# EasyEDA Pro project 分电板.eprj

# Schematic Schematic1
Board Name: Board1; Create Date: 2025-06-07; Page Name: P1; Project Name: 分电板; Schematic Name: Schematic1; Update Date: 2025-06-15; Company: 嘉立创EDA; Page Size: A4; Version: V1.0
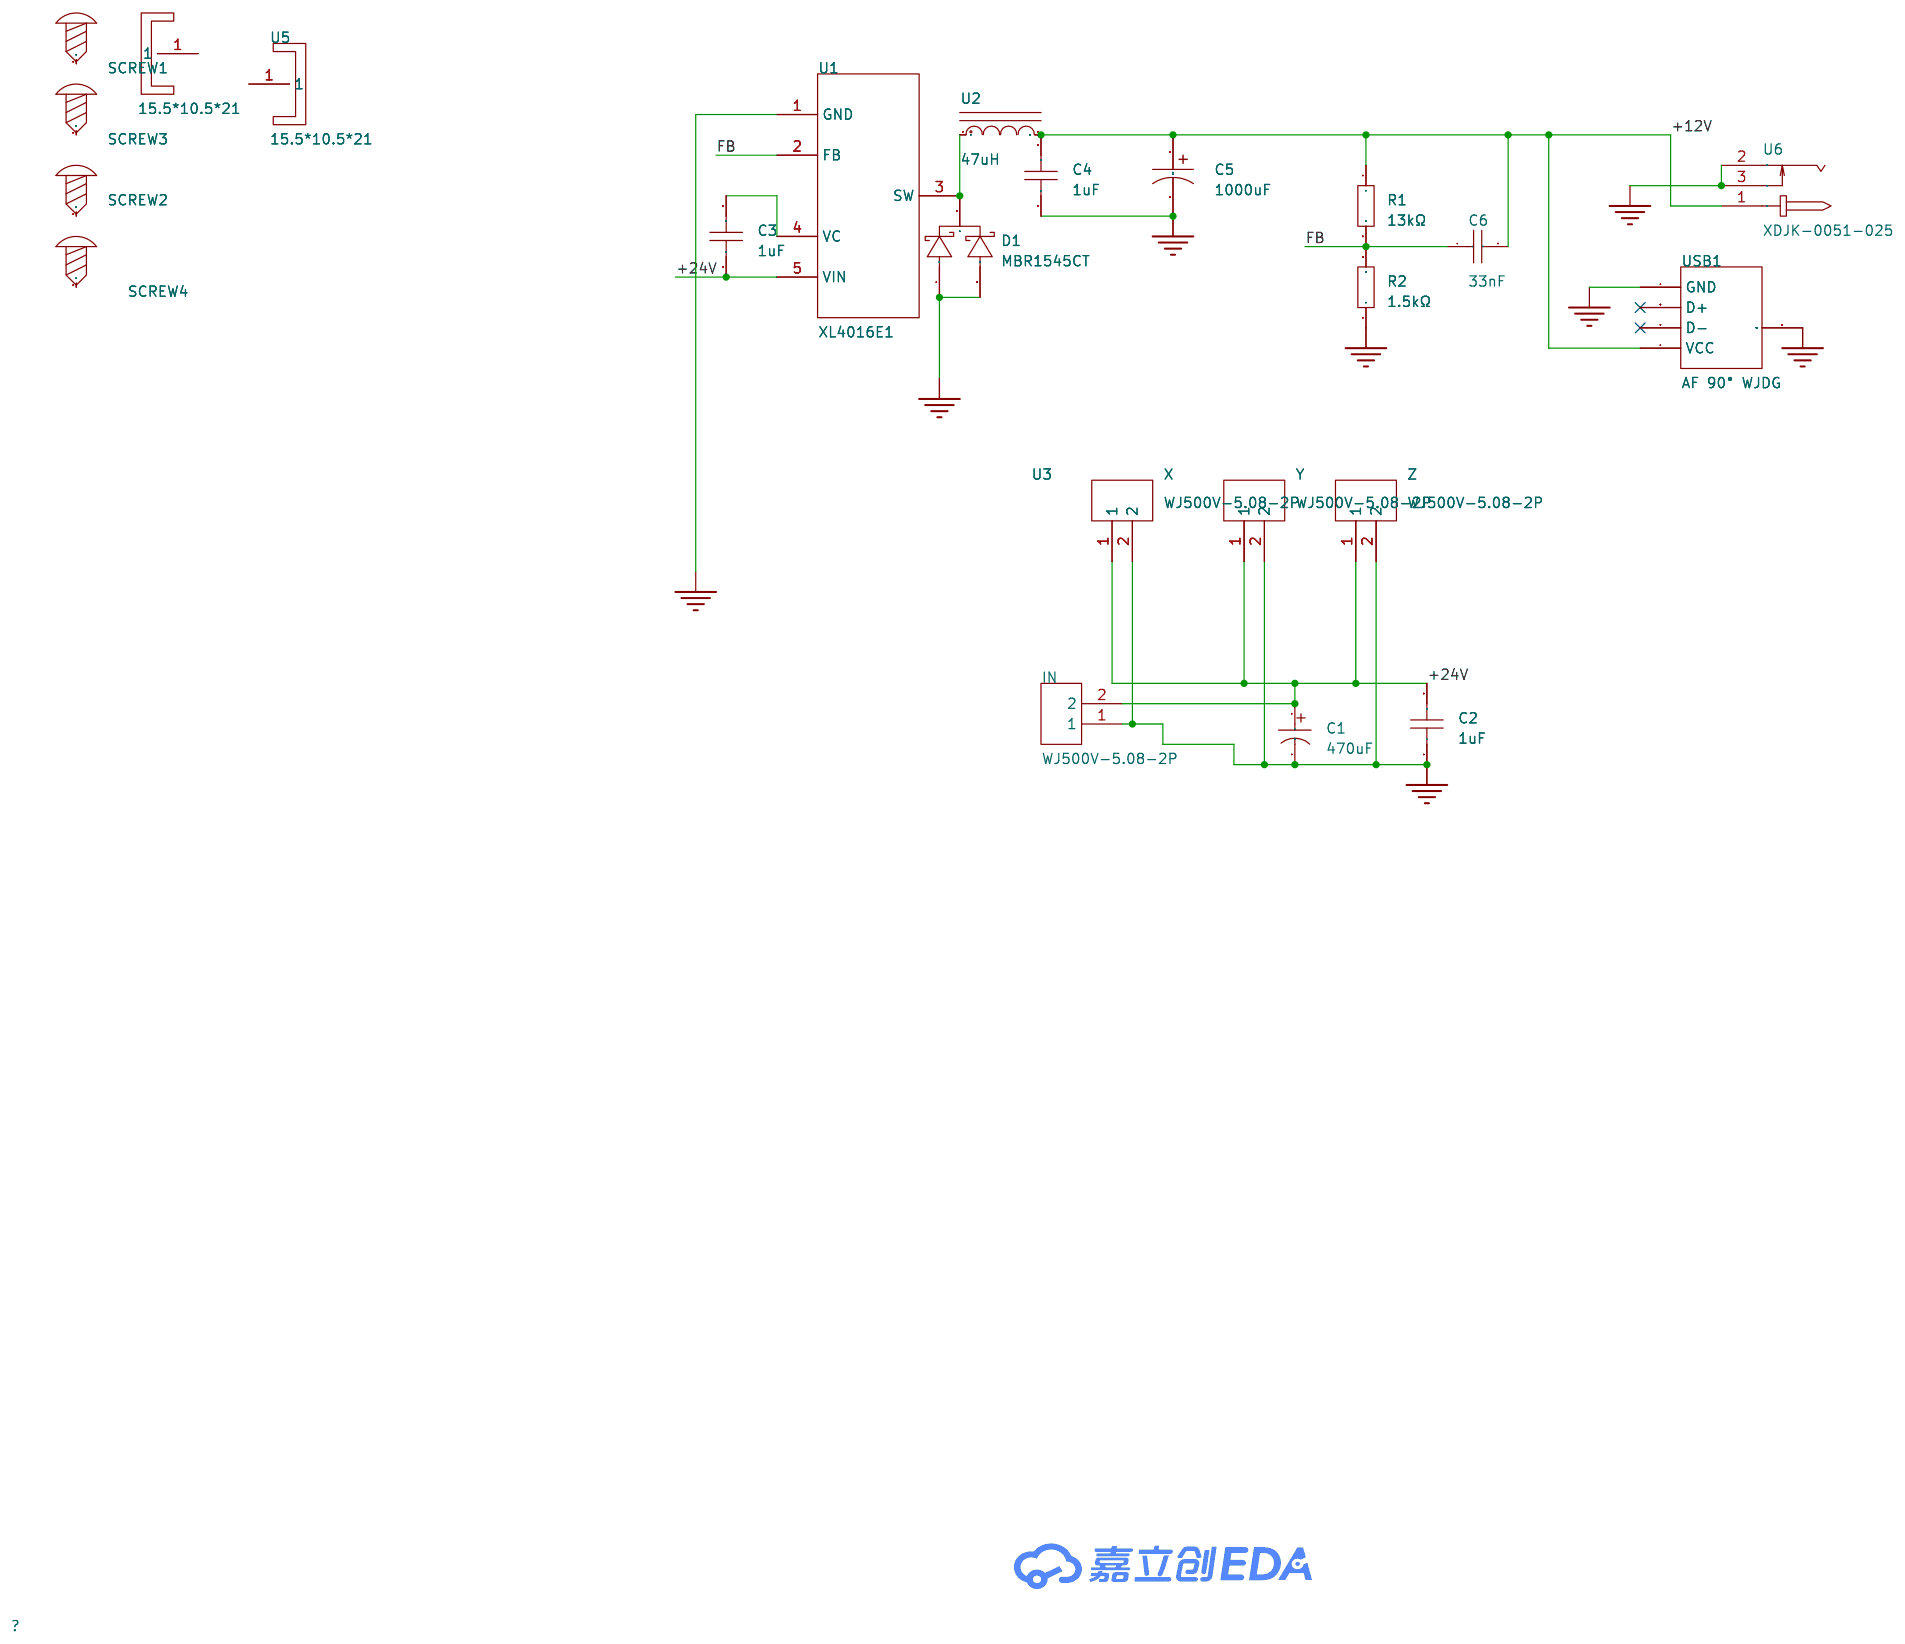
[diagram p0: schematic sheet]

## Parts
C1  470uF  [CAP-TH_BD10.0-P5.00-D1.0-FD]
C2  1uF  [C0603]
C3  1uF  [C0603]
C4  1uF  [C0603]
C5  1000uF  [CAP-TH_BD10.0-P5.00-D1.0-FD]
C6  33nF  [C0603]
D1  MBR1545CT  [ITO-220AB-3_L10.0-W4.5-P2.54-R]
IN  WJ500V-5.08-2P  [CONN-TH_2P-P5.00_WJ500V-5.08-2P]
R1  13kΩ  [R0603]
R2  1.5kΩ  [R0603]
SCREW1  -  [M3螺丝]
SCREW2  -  [M3螺丝]
SCREW3  -  [M3螺丝]
SCREW4  -  [M3螺丝]
U1  XL4016E1  [TO-220-5L_L10.2-W4.5-P1.71-L]
U2  47uH  [IND-TH_L23.2-W9.8_XR080125T101MV1L]
U3  15.5*10.5*21  [SINK-TH_L15.0-W10.5-H21.0]
U5  15.5*10.5*21  [SINK-TH_L15.0-W10.5-H21.0]
U6  XDJK-0051-025  [DC-IN-TH_XDJK-0051-025]
USB1  AF 90° WJDG  [USB-A-TH_AF-WJDG]
X  WJ500V-5.08-2P  [CONN-TH_2P-P5.00_WJ500V-5.08-2P]
Y  WJ500V-5.08-2P  [CONN-TH_2P-P5.00_WJ500V-5.08-2P]
Z  WJ500V-5.08-2P  [CONN-TH_2P-P5.00_WJ500V-5.08-2P]

## Library data of the parts
C1 = ERS1HM471G20OT: 容值:470uF;精度:±20%;额定电压:50V;; LCSC Part Name: 470uF ±20% 50V; Supplier Part: C106666; Manufacturer: AISHI(艾华集团); Supplier Footprint: 插件,D10xL20mm; JLCPCB Part Class: 扩展库; Datasheet: https://atta.szlcsc.com/upload/public/pdf/source/20191015/C438940_4B8E60A742BB0AE40DDEF87A5C89089D.pdf; Supplier: LCSC; Tolerance: ±20%; Rated Voltage: 50V; Lead Spacing: 5mm; φD: 10mm; L: 20mm; Lifetime @ Temp: 7000hrs@105℃; Check: true
C2-C4 = CL10A105KB8NNNC: 容值:1uF;精度:±10%;额定电压:50V;材质(温度系数):X5R;; LCSC Part Name: 1uF ±10% 50V; Supplier Part: C15849; Manufacturer: SAMSUNG(三星); Supplier Footprint: 0603; JLCPCB Part Class: 基础库; Datasheet: https://atta.szlcsc.com/upload/public/pdf/source/20160218/1457707763339.pdf; Supplier: LCSC; Tolerance: ±10%; Voltage Rated: 50V; Temperature Coefficient: X5R; Check: true
C5 = 01EC4294SHC1000UF25V: 容值:1000uF;精度:±20%;额定电压:25V;纹波电流:450mA@120Hz;等效串联电阻:-;; LCSC Part Name: 1000uF ±20% 25V; Supplier Part: C503217; Manufacturer: KNSCHA(科尼盛); Supplier Footprint: 插件,D10xL16mm; JLCPCB Part Class: 扩展库; Datasheet: https://atta.szlcsc.com/upload/public/pdf/source/20240806/1082112373C74E03ED6704D18D61A53D.pdf; Supplier: LCSC; Tolerance: ±20%; Rated Voltage: 25V; Ripple Current: 450mA@120Hz; Lead Spacing: 5mm; φD: 10mm; L: 16mm; Lifetime @ Temp: 5000hrs@105℃; Check: true
C6 = CL10B333KB8NNNC: 容值:33nF;精度:±10%;额定电压:50V;材质(温度系数):X7R;; LCSC Part Name: 33nF ±10% 50V; Supplier Part: C21117; Manufacturer: SAMSUNG(三星); Supplier Footprint: 0603; JLCPCB Part Class: 基础库; Datasheet: https://atta.szlcsc.com/upload/public/pdf/source/20160218/1457707763339.pdf; Supplier: LCSC; Tolerance: ±10%; Voltage Rated: 50V; Temperature Coefficient: X7R; Check: true
D1 = MBR1545CT: 正向压降(Vf):650mV@7.5A;直流反向耐压(Vr):45V;整流电流:15A;; LCSC Part Name: 电压:45V 电流:15A; Supplier Part: C698791; Manufacturer: YANGJIE(扬杰); Supplier Footprint: ITO-220AB-3; JLCPCB Part Class: 扩展库; Datasheet: https://atta.szlcsc.com/upload/public/pdf/source/20200710/C698791_04F4203A28612A5E84DEB64878736A43.pdf; Supplier: LCSC; Voltage - Forward(Vf@If): 650mV@7.5A; Voltage - DC Reverse(Vr): 45V; Current - Rectified: 15A; Check: true
IN = WJ500V-5.08-2P: 结构:1x2P;间距:5.08mm;颜色:绿色;安装方式:直插;额定电流:18A;额定电压:250V;排数:1;线规 - AWG:14~30;线规 - 平方毫米:2.5;每排PIN数:2;触头材质:-;触头镀层:-;工作温度范围:-40℃~+105℃;焊接温度(最大值):-;; LCSC Part Name: 1x2P 5.08mm 直插 排数:1 每排P数:2; Supplier Part: C8465; Manufacturer: KANGNEX(康奈克斯电气); Supplier Footprint: 插件,P=5.08mm; JLCPCB Part Class: 扩展库; Datasheet: https://atta.szlcsc.com/upload/public/pdf/source/20191225/C8465_02D34CE5B5B4A53DF5891601D97FA9F4.pdf; Supplier: LCSC; Structure: 1x2P; Pitch: 5.08mm; Color: 绿色; Mounting Style: 直插; Current Rating (Max): 18A; Voltage Rating (Max): 250V; Number of Pins: 2P; Number of Rows: 1; Wire Gauge - AWG: 14~30; Wire Gauge - mm2: 2.5; Number of PINs Per Row: 2; Operating Temperature Range: -40℃~+105℃; Screw Specification: M2.5; Check: true
R1 = 0603WAF1302T5E: 电阻类型:厚膜电阻;阻值:13kΩ;精度:±1%;功率:100mW;最大工作电压:75V;温度系数:±100ppm/℃;; LCSC Part Name: 13kΩ ±1% 100mW 厚膜电阻; Supplier Part: C22797; Manufacturer: UNI-ROYAL(厚声); Supplier Footprint: 0603; JLCPCB Part Class: 基础库; Datasheet: https://atta.szlcsc.com/upload/public/pdf/source/20200306/C422600_1E6D84923E4A46A82E41ADD87F860B5C.pdf; Supplier: LCSC; Type: 厚膜电阻; Tolerance: ±1%; Power(Watts): 100mW; Overload Voltage (Max): 75V; Temperature Coefficient: ±100ppm/℃; Operating Temperature Range: -55℃~+155℃; Check: true
R2 = 0603WAF1501T5E: 电阻类型:厚膜电阻;阻值:1.5kΩ;精度:±1%;功率:100mW;最大工作电压:75V;温度系数:±100ppm/℃;; LCSC Part Name: 1.5kΩ ±1% 100mW 厚膜电阻; Supplier Part: C22843; Manufacturer: UNI-ROYAL(厚声); Supplier Footprint: 0603; JLCPCB Part Class: 基础库; Datasheet: https://atta.szlcsc.com/upload/public/pdf/source/20200306/C422600_1E6D84923E4A46A82E41ADD87F860B5C.pdf; Supplier: LCSC; Type: 厚膜电阻; Tolerance: ±1%; Power(Watts): 100mW; Overload Voltage (Max): 75V; Temperature Coefficient: ±100ppm/℃; Operating Temperature Range: -55℃~+155℃; Check: true
SCREW1-SCREW4 = M3螺丝: Supplier Footprint: 插件
U1 = XL4016E1: 功能类型:降压型;输出类型:可调;工作电压:8V~36V;输出电压:1.25V~32V;输出电流:12A;; LCSC Part Name: 180KHz 40V 12A开关电流降压型DC-DC转换器; Supplier Part: C55881; Manufacturer: XLSEMI(芯龙); Supplier Footprint: TO-220-5; JLCPCB Part Class: 扩展库; Datasheet: https://atta.szlcsc.com/upload/public/pdf/source/20221017/BA256A5392B705775B4C335FAFB3EDCF.pdf; Supplier: LCSC; Function: 降压型; Output Type: 可调; Voltage - Supply: 8V~36V; Output Voltage: 1.25V~32V; Output Current: 12A; Frequency - Switching: 144kHz~216kHz; Operating Temperature: -40℃~+125℃; Synchronous Rectifier: 否; Number of Outputs: 1; Topology: 降压式; Quiescent Current: 2.1mA; Switch tube (built-in/external): 内置; Check: true
U2 = XR080125T470MV1L: LCSC Part Name: 47uH ±10% 磁环电感; Supplier Part: C18213936; Manufacturer: XR(祥如); Supplier Footprint: 插件,D=23.2mm; JLCPCB Part Class: Extended Part; Datasheet: https://atta.szlcsc.com/upload/public/pdf/source/20231010/90354A884368C4364674BF151294FED0.pdf; Supplier: LCSC; Tolerance: ±10%; Rated Current: 7.8A; Type: 磁环电感; Wire Diameter: 1mm
U3 U5 = 15.5*10.5*21: 产品尺寸:15.5*10.5*21MM;材 质:6063-T5;; LCSC Part Name: H型散热片; Supplier Part: C4649; Manufacturer: XSD(鑫顺达); JLCPCB Part Class: 扩展库; Datasheet: https://atta.szlcsc.com/upload/public/pdf/source/20171202/C4649_15122106328221160233.pdf; Supplier: LCSC; ProductSize: 15.5*10.5*21MM; Colour: 白色; TextureOfMaterial: 6063-T5; SurfaceTreatment: 本色洗白; Shape: H型; SpringBuckle: -；-；-；-；-；-；-；-; Check: true
U6 = XDJK-0051-025: LCSC Part Name: DC电源插座 内径:2.1mm 外径:6.3mm; Supplier Part: C7498153; Manufacturer: LX(连欣科技); Supplier Footprint: 插件; JLCPCB Part Class: 扩展库; Datasheet: https://atta.szlcsc.com/upload/public/pdf/source/20230918/E992A0986F3EC147C0E09AECB36E3CC9.pdf; Supplier: LCSC; Connector Type: DC电源插座; Mounting Style: 弯插; Inside Contact Diameter: 2.1mm; Outside Contact Diameter: 6.3mm; Current Rating (Max): 3A; Voltage Rating (Max): 500V; Contact Plating: 锡; Operating Temperature Range: -40℃~+85℃; Soldering Temperature(Max): 265℃; Check: true
USB1 = AF 90° WJDG: 连接器类型:Type-A;标准:USB 2.0;公母:母;安装方式:弯插;触点数量:4P;端口数量:1;额定电流 - 电源:1.5A;工作温度范围:-25℃~+85℃;; LCSC Part Name: Type-A 母 弯插; Supplier Part: C456018; Manufacturer: SHOU HAN(首韩); Supplier Footprint: 插件; JLCPCB Part Class: 扩展库; Datasheet: https://atta.szlcsc.com/upload/public/pdf/source/20241125/1CC41152EE29FFE03A5868591A920D3B.pdf; Supplier: LCSC; Connector Type: Type-A; Standard: USB 2.0; Gender: 母; Mounting Style: 弯插; Number of Contacts: 4P; Number of Ports: 1; Current Rating - Power (Max): 1.5A; Rated Voltage (Max): 30V; Connect-Disconnect Life: 5千次; Length: 14mm; Core Colour: 白色; Operating Temperature Range: -25℃~+85℃; Check: true
X Y Z = WJ500V-5.08-2P: 结构:1x2P;间距:5.08mm;颜色:绿色;安装方式:直插;额定电流:18A;额定电压:250V;排数:1;线规 - AWG:14~30;线规 - 平方毫米:2.5;每排PIN数:2;触头材质:-;触头镀层:-;工作温度范围:-40℃~+105℃;焊接温度(最大值):-;; LCSC Part Name: 1x2P 5.08mm 直插 排数:1 每排P数:2; Supplier Part: C8465; Manufacturer: KANGNEX(康奈克斯电气); Supplier Footprint: 插件,P=5.08mm; JLCPCB Part Class: 扩展库; Datasheet: https://atta.szlcsc.com/upload/public/pdf/source/20191225/C8465_02D34CE5B5B4A53DF5891601D97FA9F4.pdf; Supplier: LCSC; Structure: 1x2P; Pitch: 5.08mm; Color: 绿色; Mounting Style: 直插; Current Rating (Max): 18A; Voltage Rating (Max): 250V; Number of Pins: 2P; Number of Rows: 1; Wire Gauge - AWG: 14~30; Wire Gauge - mm2: 2.5; Number of PINs Per Row: 2; Operating Temperature Range: -40℃~+105℃; Screw Specification: M2.5

## Nets
+12V: C4.2 C5.1 C6.2 R1.1 U2.2 U6.1 USB1.1(VCC)
+24V: C1.1 C2.2 C3.1 IN.2 U1.5(VIN) X.1 Y.1 Z.1
GND: C1.2 C2.1 C4.1 C5.2 D1.1 D1.3 IN.1 R2.1 U1.1(GND) U6.2 U6.3 USB1.4(GND) USB1.5(SHLD) X.2 Y.2 Z.2
FB: C6.1 R1.2 R2.2 U1.2(FB)
$1N1341: C3.2 U1.4(VC)
$1N8394: D1.2 U1.3(SW) U2.1

Not connected (* = marked no-connect by the designer): SCREW1 1; SCREW2 1; SCREW3 1; SCREW4 1; U3 1; U5 1; USB1 2(D-)* 3(D+)*

# Board PCB1
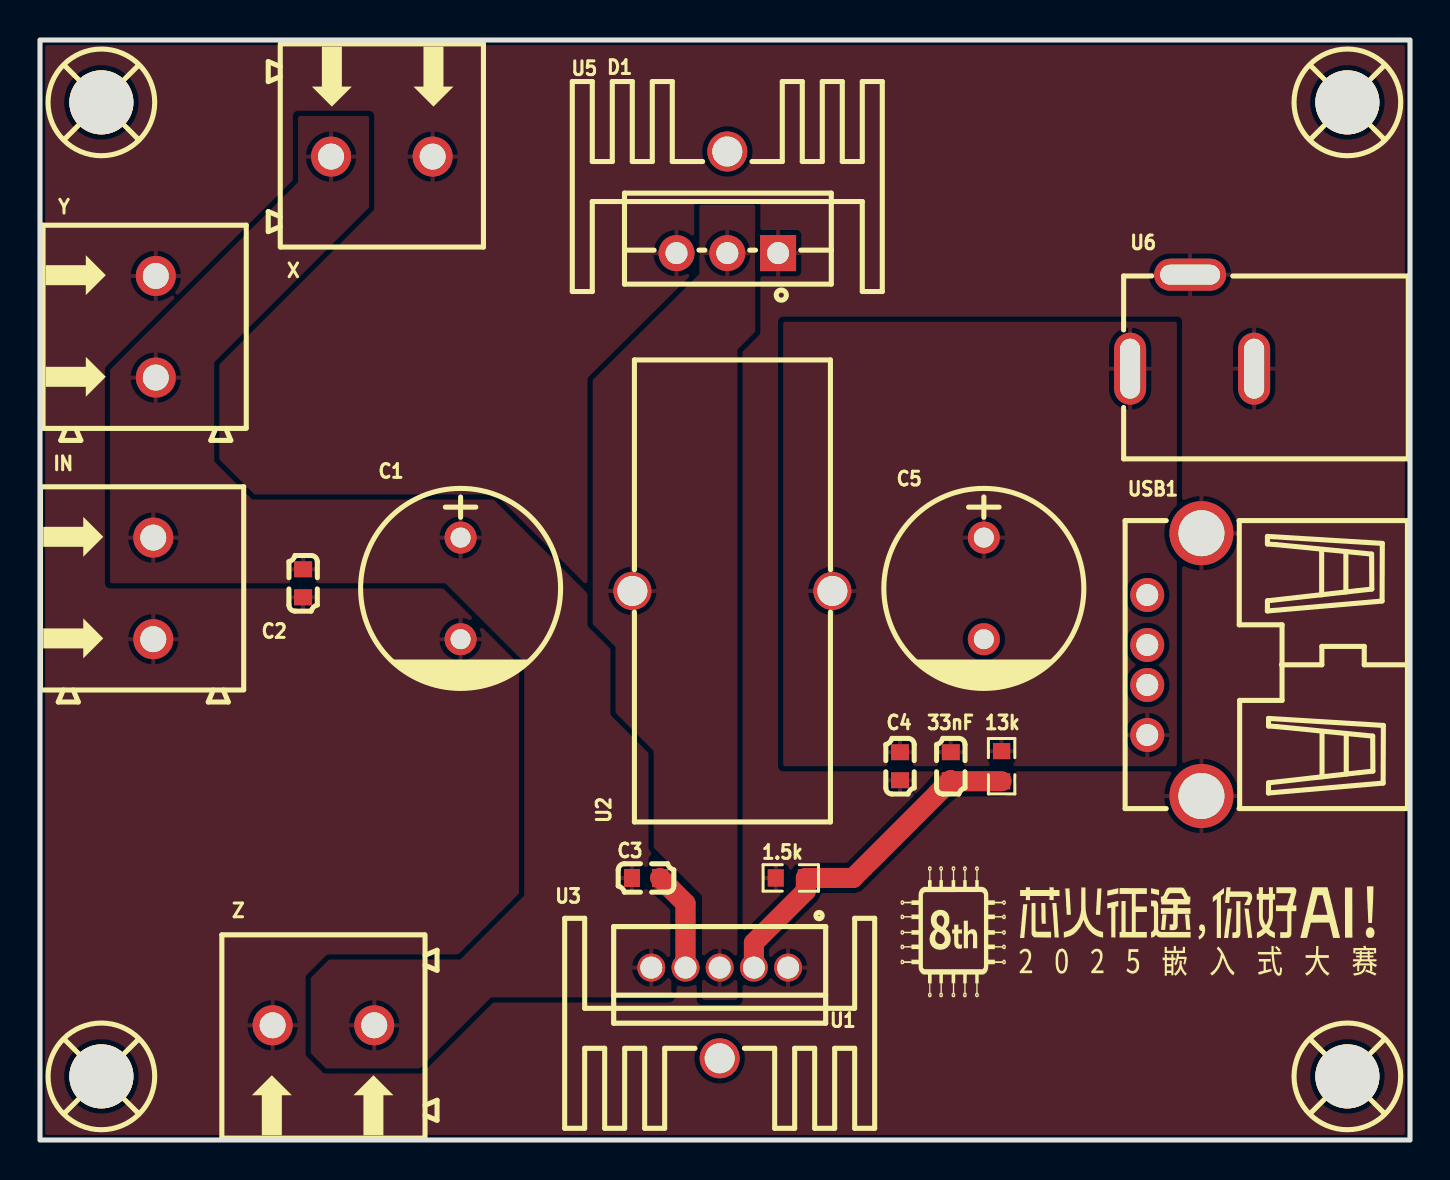
[diagram p1: board, top side]
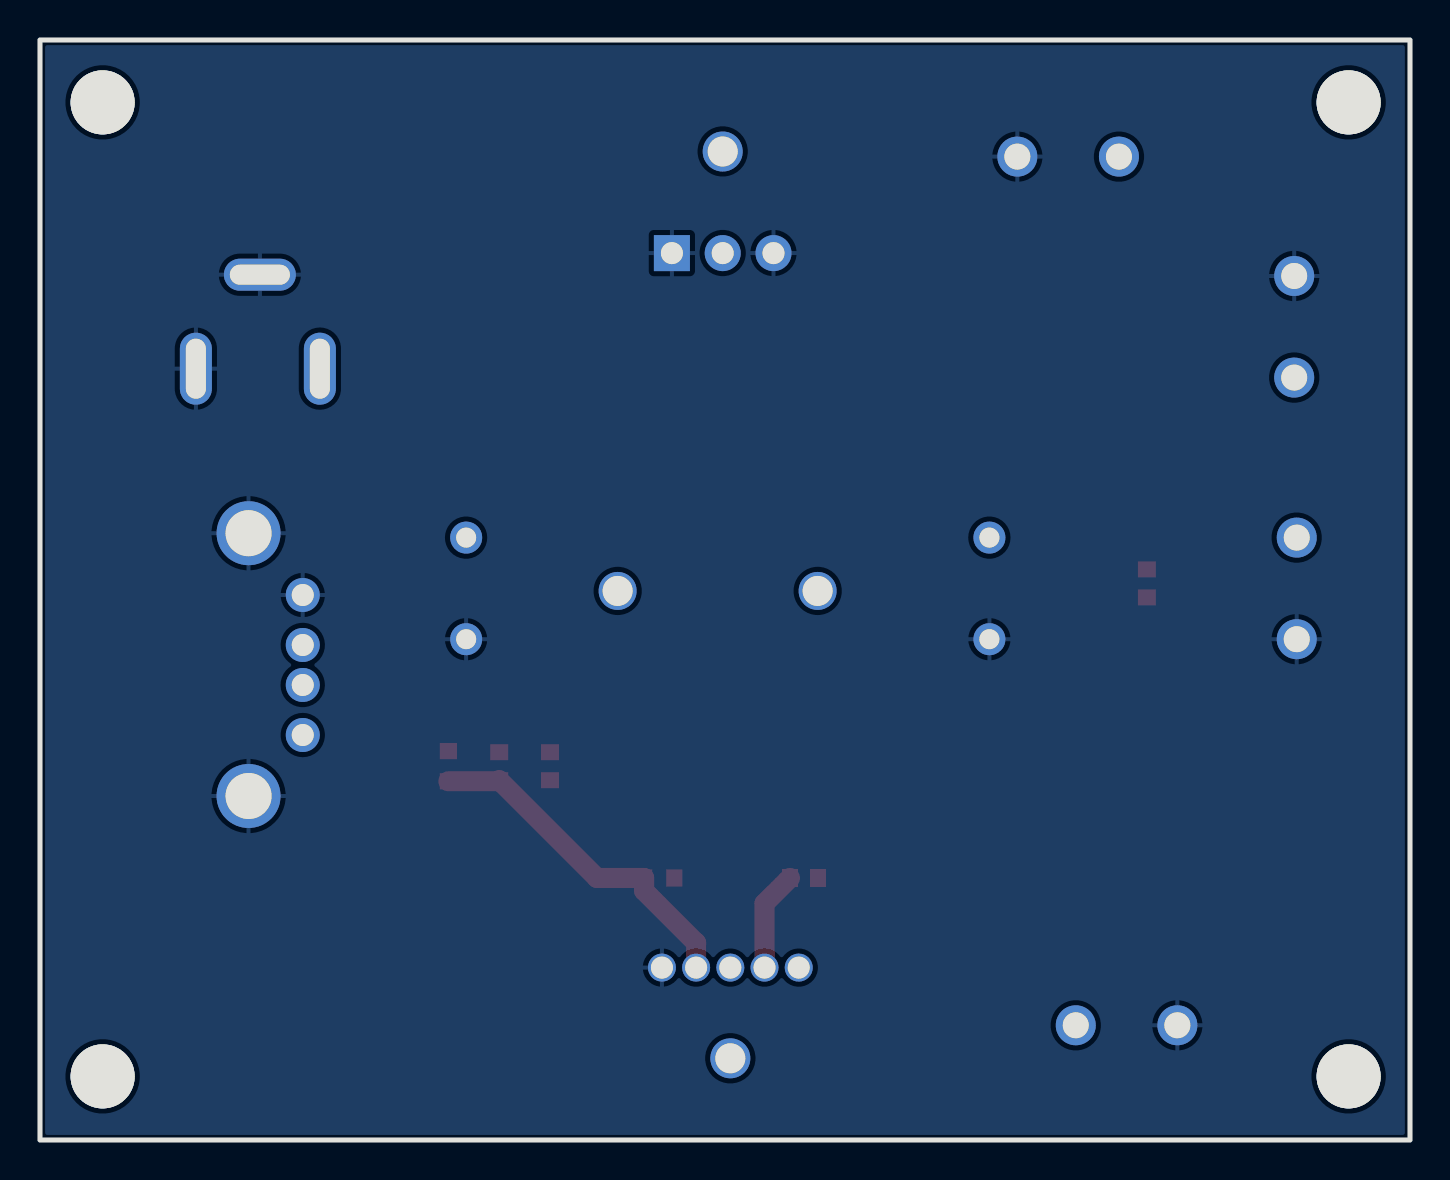
[diagram p2: board, bottom side, seen from below]

Outline 68.5 x 55 mm; copper layers: Top Layer, Bottom Layer. Coordinates in mm from the lower left corner of the outline.
Outline path: rectangle 0,55 68.5,0
Stack: Top Layer 0.035mm / Dielectric1 1.51mm FR4 er 4.5 / Bottom Layer 0.035mm

## Design rules (mm)
template: JLCPCB Capability(Two Layers Board)
spacing copperThickness1oz (default): track to track 0.102, other pairs 0.152 to 0.3
spacing copperThickness2oz: track to track 0.203, other pairs 0.152 to 0.3
track width copperThickness1oz (default): min 0.127, default 0.254, max 2.54
track width copperThickness2oz: min 0.203, default 0.254, max 2.54
differential pair differentialPair (default): width min 0.127, default 0.254, max 2.54; gap min 0.152, default 0.152
via viaSize (default): diameter min 0.5, default 0.61, max 10; hole min 0.3, default 0.305, max 6.3

## Placement (name value [footprint] x y rotation side)
1.5k  1.5kΩ  [R0603]  37.54 13.1 0 top
33nF  33nF  [C0603]  45.54 18.69 90 top
 13k  13kΩ  [R0603]  48.08 18.69 270 top
C1  470uF  [CAP-TH_BD10.0-P5.00-D1.0-FD]  21.03 27.58 270 top
C2  1uF  [C0603]  13.16 27.83 90 top
C3  1uF  [C0603]  30.3 13.1 0 top
C4  1uF  [C0603]  43 18.69 90 top
C5  1000uF  [CAP-TH_BD10.0-P5.00-D1.0-FD]  47.19 27.58 270 top
D1  MBR1545CT  [ITO-220AB-3_L10.0-W4.5-P2.54-R]  34.37 44.34 0 top
IN  WJ500V-5.08-2P  [CONN-TH_2P-P5.00_WJ500V-5.08-2P]  5.66 27.58 90 top
SCREW1  -  [M3螺丝]  3.07 3.18 0 top
SCREW2  -  [M3螺丝]  3.07 51.88 0 top
SCREW3  -  [M3螺丝]  65.37 51.88 0 top
SCREW4  -  [M3螺丝]  65.37 3.18 0 top
U1  XL4016E1  [TO-220-5L_L10.2-W4.5-P1.71-L]  33.98 8.62 180 top
U2  47uH  [IND-TH_L23.2-W9.8_XR080125T101MV1L]  34.62 27.45 90 top
U3  15.5*10.5*21  [SINK-TH_L15.0-W10.5-H21.0]  33.98 4.08 180 top
U5  15.5*10.5*21  [SINK-TH_L15.0-W10.5-H21.0]  34.37 49.42 0 top
U6  XDJK-0051-025  [DC-IN-TH_XDJK-0051-025]  57.61 40.91 180 top
USB1  AF 90° WJDG  [USB-A-TH_AF-WJDG]  56.72 23.77 90 top
X  WJ500V-5.08-2P  [CONN-TH_2P-P5.00_WJ500V-5.08-2P]  17.09 49.17 0 top
Y  WJ500V-5.08-2P  [CONN-TH_2P-P5.00_WJ500V-5.08-2P]  5.79 40.66 90 top
Z  WJ500V-5.08-2P  [CONN-TH_2P-P5.00_WJ500V-5.08-2P]  14.17 5.74 180 top

## Footprints (pads in the part's own frame, mm; a bottom-side part is the same pattern mirrored in y, then rotated)
C0603
  rect 0.8x0.9 smd: 1(-0.7,0) 2(0.7,0)
CAP-TH_BD10.0-P5.00-D1.0-FD
  round 1.6 hole 1: 1(-2.54,0) 2(2.54,0)
CONN-TH_2P-P5.00_WJ500V-5.08-2P
  round 2 hole 1.3: 1(-2.54,0) 2(2.54,0)
DC-IN-TH_XDJK-0051-025
  oval 1.6x3.6 hole 1x3: 1(3.1,2.35) 2(-3.1,2.35)
  oval 3.6x1.6 hole 3x1: 3(0.1,-2.35)
IND-TH_L23.2-W9.8_XR080125T101MV1L
  round 1.9 hole 1.5x1.4: 1(0,5) 2(0,-5)
ITO-220AB-3_L10.0-W4.5-P2.54-R
  rect 1.8x1.8 hole 1.1: 1(2.54,0)
  round 1.8 hole 1.1: 2(0,0) 3(-2.54,0)
M3螺丝
  round 3.2 hole 3.2: 1(0,0)
R0603
  rect 0.806x0.864 smd: 1(-0.753,0) 2(0.753,0)
SINK-TH_L15.0-W10.5-H21.0
  round 2 hole 1.5: 1(0,0)
TO-220-5L_L10.2-W4.5-P1.71-L
  round 1.4 hole 1.1: 1(-3.42,0) 2(-1.71,0) 3(0,0) 4(1.71,0) 5(3.42,0)
USB-A-TH_AF-WJDG
  round 1.7 hole 1.1: 1(-3.521,1.355) 2(-1.018,1.355) 3(0.981,1.355) 4(3.48,1.355)
  round 3.2 hole 2.3: 5(-6.57,-1.355) 5(6.57,-1.355)

## Nets
+12V: 33nF.2  13k.1 C4.2 C5.1 U2.2 U6.1 USB1.1
+24V: C1.1 C2.2 C3.1 IN.2 U1.5 X.1 Y.1 Z.1
GND: 1.5k.1 C1.2 C2.1 C4.1 C5.2 D1.1 D1.3 IN.1 U1.1 U6.2 U6.3 USB1.4 USB1.5 X.2 Y.2 Z.2
FB: 1.5k.2 33nF.1  13k.2 U1.2
$1N1341: C3.2 U1.4
$1N8394: D1.2 U1.3 U2.1

Pads without a net: SCREW1 1; SCREW2 1; SCREW3 1; SCREW4 1; U3 1; U5 1; USB1 2 3

## Routing (per net, layer and track width the routed paths; a pad name or vN(x,y) marks a point on that pad's centre or on a via; arc(x,y) is an arc through that point)
FB: length 17.4
  Top Layer w1:  13k.2 45.59,17.94 33nF.1 40.65,13.1 1.5k.2 38.29,12.46 35.69,9.86 U1.2
$1N1341: length 5
  Top Layer w1: C3.2 32.27,11.83 U1.4

## Copper pours and planes (outline as drawn; the poured copper is in the pictures)
+12V on Top Layer: 37.16,40.91 56.84,40.91 56.84,18.69 37.16,18.69
+24V on Top Layer: 12.9,51.2 16.46,51.2 16.46,46.63 8.71,38.88 8.71,33.93 10.62,32.02 22.68,32.02 27.51,27.2 27.51,25.67 28.65,24.53 28.65,21.23 30.56,19.32 30.56,14.24 30.43,14.12 30.43,12.59 31.57,11.45 31.57,7.26 31.44,7.13 22.55,7.13 19,3.58 14.3,3.58 13.54,4.34 13.54,8.1 14.46,9.02 21.02,9.02 24.21,12.21 24.21,23.9 20.27,27.83 3.5,27.83 3.5,38.51 12.9,47.89
GND on Top Layer: 0,55 68.5,55 68.5,0 0,0
GND on Bottom Layer: 0,55 68.5,55 68.5,0 0,0
$1N8394 on Top Layer: 33.09,7.01 34.87,7.01 34.87,39.52 35.76,40.41 35.76,46.76 32.97,46.76 32.97,43.3 27.63,38 27.63,25.8 28.78,24.66 28.78,21.36 30.68,19.45 30.68,14.63 33.09,12.21

Small or netless copper shapes (teardrops, artwork), in the pictures only: 4 on Top Layer
